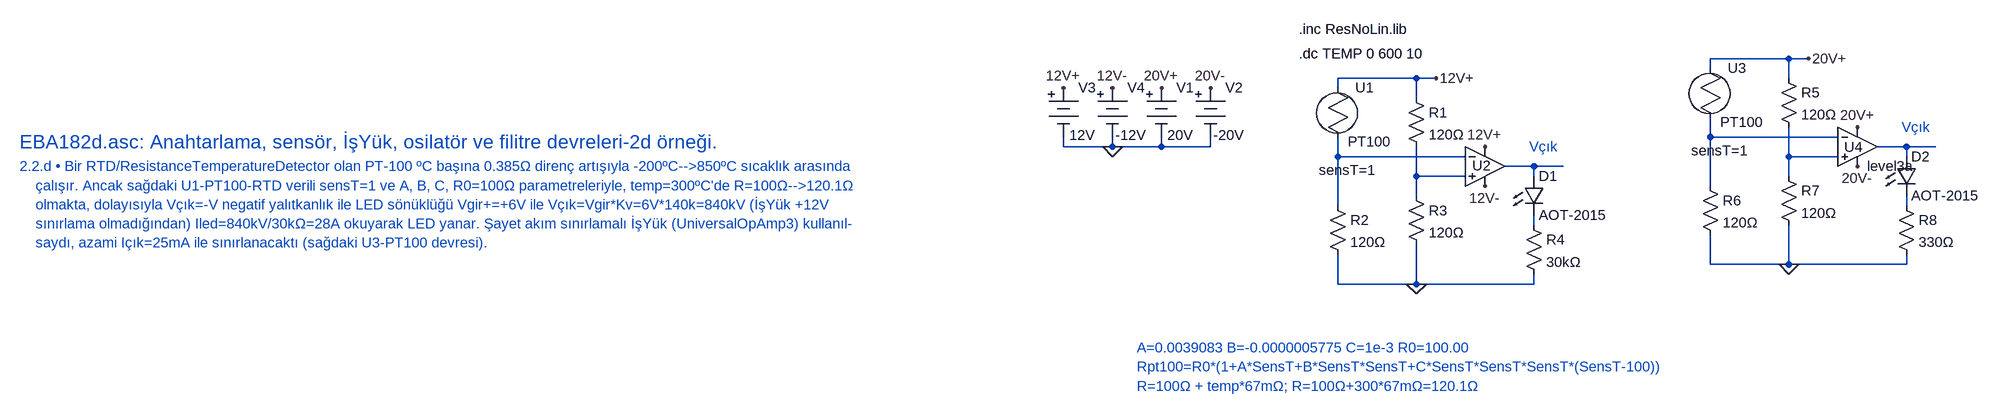
[diagram p0: schematic EBA182d.asc]
EBA182d.asc, the LTspice schematic file:
Version 4
SHEET 1 7064 4332
WIRE 2656 -80 2528 -80
WIRE 2688 -80 2656 -80
WIRE 2528 -64 2528 -80
WIRE 2048 -48 1920 -48
WIRE 2080 -48 2048 -48
WIRE 2656 -48 2656 -80
WIRE 1920 -32 1920 -48
WIRE 2048 -16 2048 -48
WIRE 2528 48 2528 16
WIRE 2736 48 2528 48
WIRE 1472 64 1472 48
WIRE 1552 64 1552 48
WIRE 1552 64 1472 64
WIRE 1632 64 1632 48
WIRE 1632 64 1552 64
WIRE 1712 64 1712 48
WIRE 1712 64 1632 64
WIRE 2848 64 2800 64
WIRE 2896 64 2848 64
WIRE 1920 80 1920 48
WIRE 2128 80 1920 80
WIRE 2656 80 2656 32
WIRE 2736 80 2656 80
WIRE 2848 80 2848 64
WIRE 2240 96 2192 96
WIRE 2288 96 2240 96
WIRE 2048 112 2048 64
WIRE 2128 112 2048 112
WIRE 2240 112 2240 96
WIRE 2656 112 2656 80
WIRE 2528 128 2528 48
WIRE 2048 144 2048 112
WIRE 1920 160 1920 80
WIRE 2848 160 2848 144
WIRE 2240 192 2240 176
WIRE 2528 256 2528 208
WIRE 2656 256 2656 192
WIRE 2656 256 2528 256
WIRE 2848 256 2848 240
WIRE 2848 256 2656 256
WIRE 1920 288 1920 240
WIRE 2048 288 2048 224
WIRE 2048 288 1920 288
WIRE 2240 288 2240 272
WIRE 2240 288 2048 288
FLAG 1632 -32 20V+
FLAG 1712 -32 20V-
FLAG 2160 64 12V+
FLAG 2080 -48 12V+
FLAG 2048 288 0
FLAG 2160 128 12V-
FLAG 2768 32 20V+
FLAG 2688 -80 20V+
FLAG 2656 256 0
FLAG 2768 96 20V-
FLAG 1472 -32 12V+
FLAG 1552 64 0
FLAG 1552 -32 12V-
SYMBOL Misc\\battery 1632 -48 R0
WINDOW 3 10 93 Left 2
SYMATTR Value 20V
SYMATTR InstName V1
SYMBOL Misc\\battery 1712 -48 R0
WINDOW 3 5 93 Left 2
SYMATTR Value -20V
SYMATTR InstName V2
SYMBOL res 2032 -32 R0
SYMATTR InstName R1
SYMATTR Value 120Ω
SYMBOL res 1904 144 R0
SYMATTR InstName R2
SYMATTR Value 120Ω
SYMBOL res 2032 128 R0
SYMATTR InstName R3
SYMATTR Value 120Ω
SYMBOL LED 2224 112 R0
SYMATTR InstName D1
SYMATTR Value AOT-2015
SYMATTR Description Diode
SYMATTR Type diode
SYMBOL res 2224 176 R0
SYMATTR InstName R4
SYMATTR Value 30kΩ
SYMBOL pt100 1904 -48 R0
WINDOW 0 44 16 Left 2
WINDOW 3 -15 150 Left 2
WINDOW 38 68 104 Center 2
SYMATTR InstName U1
SYMATTR Value sensT=1
SYMATTR Value2 A=0.0039083 B=-0.0000005775 C=1e-3
SYMBOL res 2640 -64 R0
SYMATTR InstName R5
SYMATTR Value 120Ω
SYMBOL res 2512 112 R0
SYMATTR InstName R6
SYMATTR Value 120Ω
SYMBOL res 2640 96 R0
SYMATTR InstName R7
SYMATTR Value 120Ω
SYMBOL LED 2832 80 R0
SYMATTR InstName D2
SYMATTR Value AOT-2015
SYMATTR Description Diode
SYMATTR Type diode
SYMBOL res 2832 144 R0
SYMATTR InstName R8
SYMATTR Value 330Ω
SYMBOL pt100 2512 -80 R0
WINDOW 0 44 16 Left 2
WINDOW 3 -15 150 Left 2
WINDOW 38 68 104 Center 2
SYMATTR InstName U3
SYMATTR Value sensT=1
SYMATTR Value2 A=0.0039083 B=-0.0000005775 C=1e-3
SYMBOL OpAmps\\UniversalOpAmp3 2768 64 R0
WINDOW 0 -22 1 Left 2
SYMATTR InstName U4
SYMBOL OpAmps\\UniversalOpAmp 2160 96 R0
WINDOW 0 -21 -1 Left 2
SYMATTR InstName U2
SYMBOL Misc\\battery 1472 -48 R0
WINDOW 3 10 93 Left 2
SYMATTR Value 12V
SYMATTR InstName V3
SYMBOL Misc\\battery 1552 -48 R0
WINDOW 3 5 93 Left 2
SYMATTR Value -12V
SYMATTR InstName V4
TEXT -232 56 Left 3 ;EBA182d.asc: Anahtarlama, sensör, İşYük, osilatör ve filitre devreleri-2d örneği.
TEXT -232 96 Left 2 ;2.2.d • Bir RTD/ResistanceTemperatureDetector olan PT-100 ºC başına 0.385Ω direnç artışıyla -200ºC-->850ºC sıcaklık arasında \n    çalışır. Ancak sağdaki U1-PT100-RTD verili sensT=1 ve A, B, C, R0=100Ω parametreleriyle, temp=300ºC'de R=100Ω-->120.1Ω \n    olmakta, dolayısıyla Vçık=-V negatif yalıtkanlık ile LED sönüklüğü Vgir+=+6V ile Vçık=Vgir*Kv=6V*140k=840kV (İşYük +12V \n    sınırlama olmadığından) Iled=840kV/30kΩ=28A okuyarak LED yanar. Şayet akım sınırlamalı İşYük (UniversalOpAmp3) kullanıl-\n    saydı, azami Içık=25mA ile sınırlanacaktı (sağdaki U3-PT100 devresi).
TEXT 1592 392 Left 2 ;A=0.0039083 B=-0.0000005775 C=1e-3 R0=100.00\nRpt100=R0*(1+A*SensT+B*SensT*SensT+C*SensT*SensT*SensT*(SensT-100))\nR=100Ω + temp*67mΩ; R=100Ω+300*67mΩ=120.1Ω
TEXT 2232 64 Left 2 ;Vçık
TEXT 1856 -88 Left 2 !.dc TEMP 0 600 10
TEXT 1856 -128 Left 2 !.inc ResNoLin.lib
TEXT 2840 32 Left 2 ;Vçık

The netlist it stands for:
* EBA182d.asc
V1 20V+ 0 20V
V2 20V- 0 -20V
R1 12V+ N006 120Ω
R2 N003 0 120Ω
R3 N006 0 120Ω
D1 N005 N008 AOT-2015
R4 N008 0 30kΩ
XU1 12V+ N003 PT100 sensT=1 A=0.0039083 B=-0.0000005775 C=1e-3  ; pins A B
R5 20V+ N004 120Ω
R6 N001 0 120Ω
R7 N004 0 120Ω
D2 N002 N007 AOT-2015
R8 N007 0 330Ω
XU3 20V+ N001 PT100 sensT=1 A=0.0039083 B=-0.0000005775 C=1e-3  ; pins A B
XU4 N004 N001 20V+ 20V- N002 level3a  ; pins In+ In- V+ V- OUT
XU2 N006 N003 12V+ 12V- N005 level1 Avol=1Meg GBW=10Meg Vos=0 En=0 Enk=0 In=0 Ink=0 Rin=500Meg  ; pins In+ In- V+ V- OUT
V3 12V+ 0 12V
V4 12V- 0 -12V
.model D D
.lib standard.dio
* EBA182d.asc: Anahtarlama, sensör, İşYük, osilatör ve filitre devreleri-2d örneği.
* 2.2.d • Bir RTD/ResistanceTemperatureDetector olan PT-100 ºC başına 0.385Ω direnç artışıyla -200ºC-->850ºC sıcaklık arasında
*     çalışır. Ancak sağdaki U1-PT100-RTD verili sensT=1 ve A, B, C, R0=100Ω parametreleriyle, temp=300ºC'de R=100Ω-->120.1Ω
*     olmakta, dolayısıyla Vçık=-V negatif yalıtkanlık ile LED sönüklüğü Vgir+=+6V ile Vçık=Vgir*Kv=6V*140k=840kV (İşYük +12V
*     sınırlama olmadığından) Iled=840kV/30kΩ=28A okuyarak LED yanar. Şayet akım sınırlamalı İşYük (UniversalOpAmp3) kullanıl-
*     saydı, azami Içık=25mA ile sınırlanacaktı (sağdaki U3-PT100 devresi).
* A=0.0039083 B=-0.0000005775 C=1e-3 R0=100.00
* Rpt100=R0*(1+A*SensT+B*SensT*SensT+C*SensT*SensT*SensT*(SensT-100))
* R=100Ω + temp*67mΩ; R=100Ω+300*67mΩ=120.1Ω
* Vçık
.dc TEMP 0 600 10
.inc ResNoLin.lib
* Vçık
.lib ResNoLin.Lib
.lib UniversalOpAmp1.lib
.backanno
.end